# Altium project PCB_15122020_01BB.PrjPcb (part 8 of 9)

## Sheet RTC_SD_HDMI.SchDoc
size A3
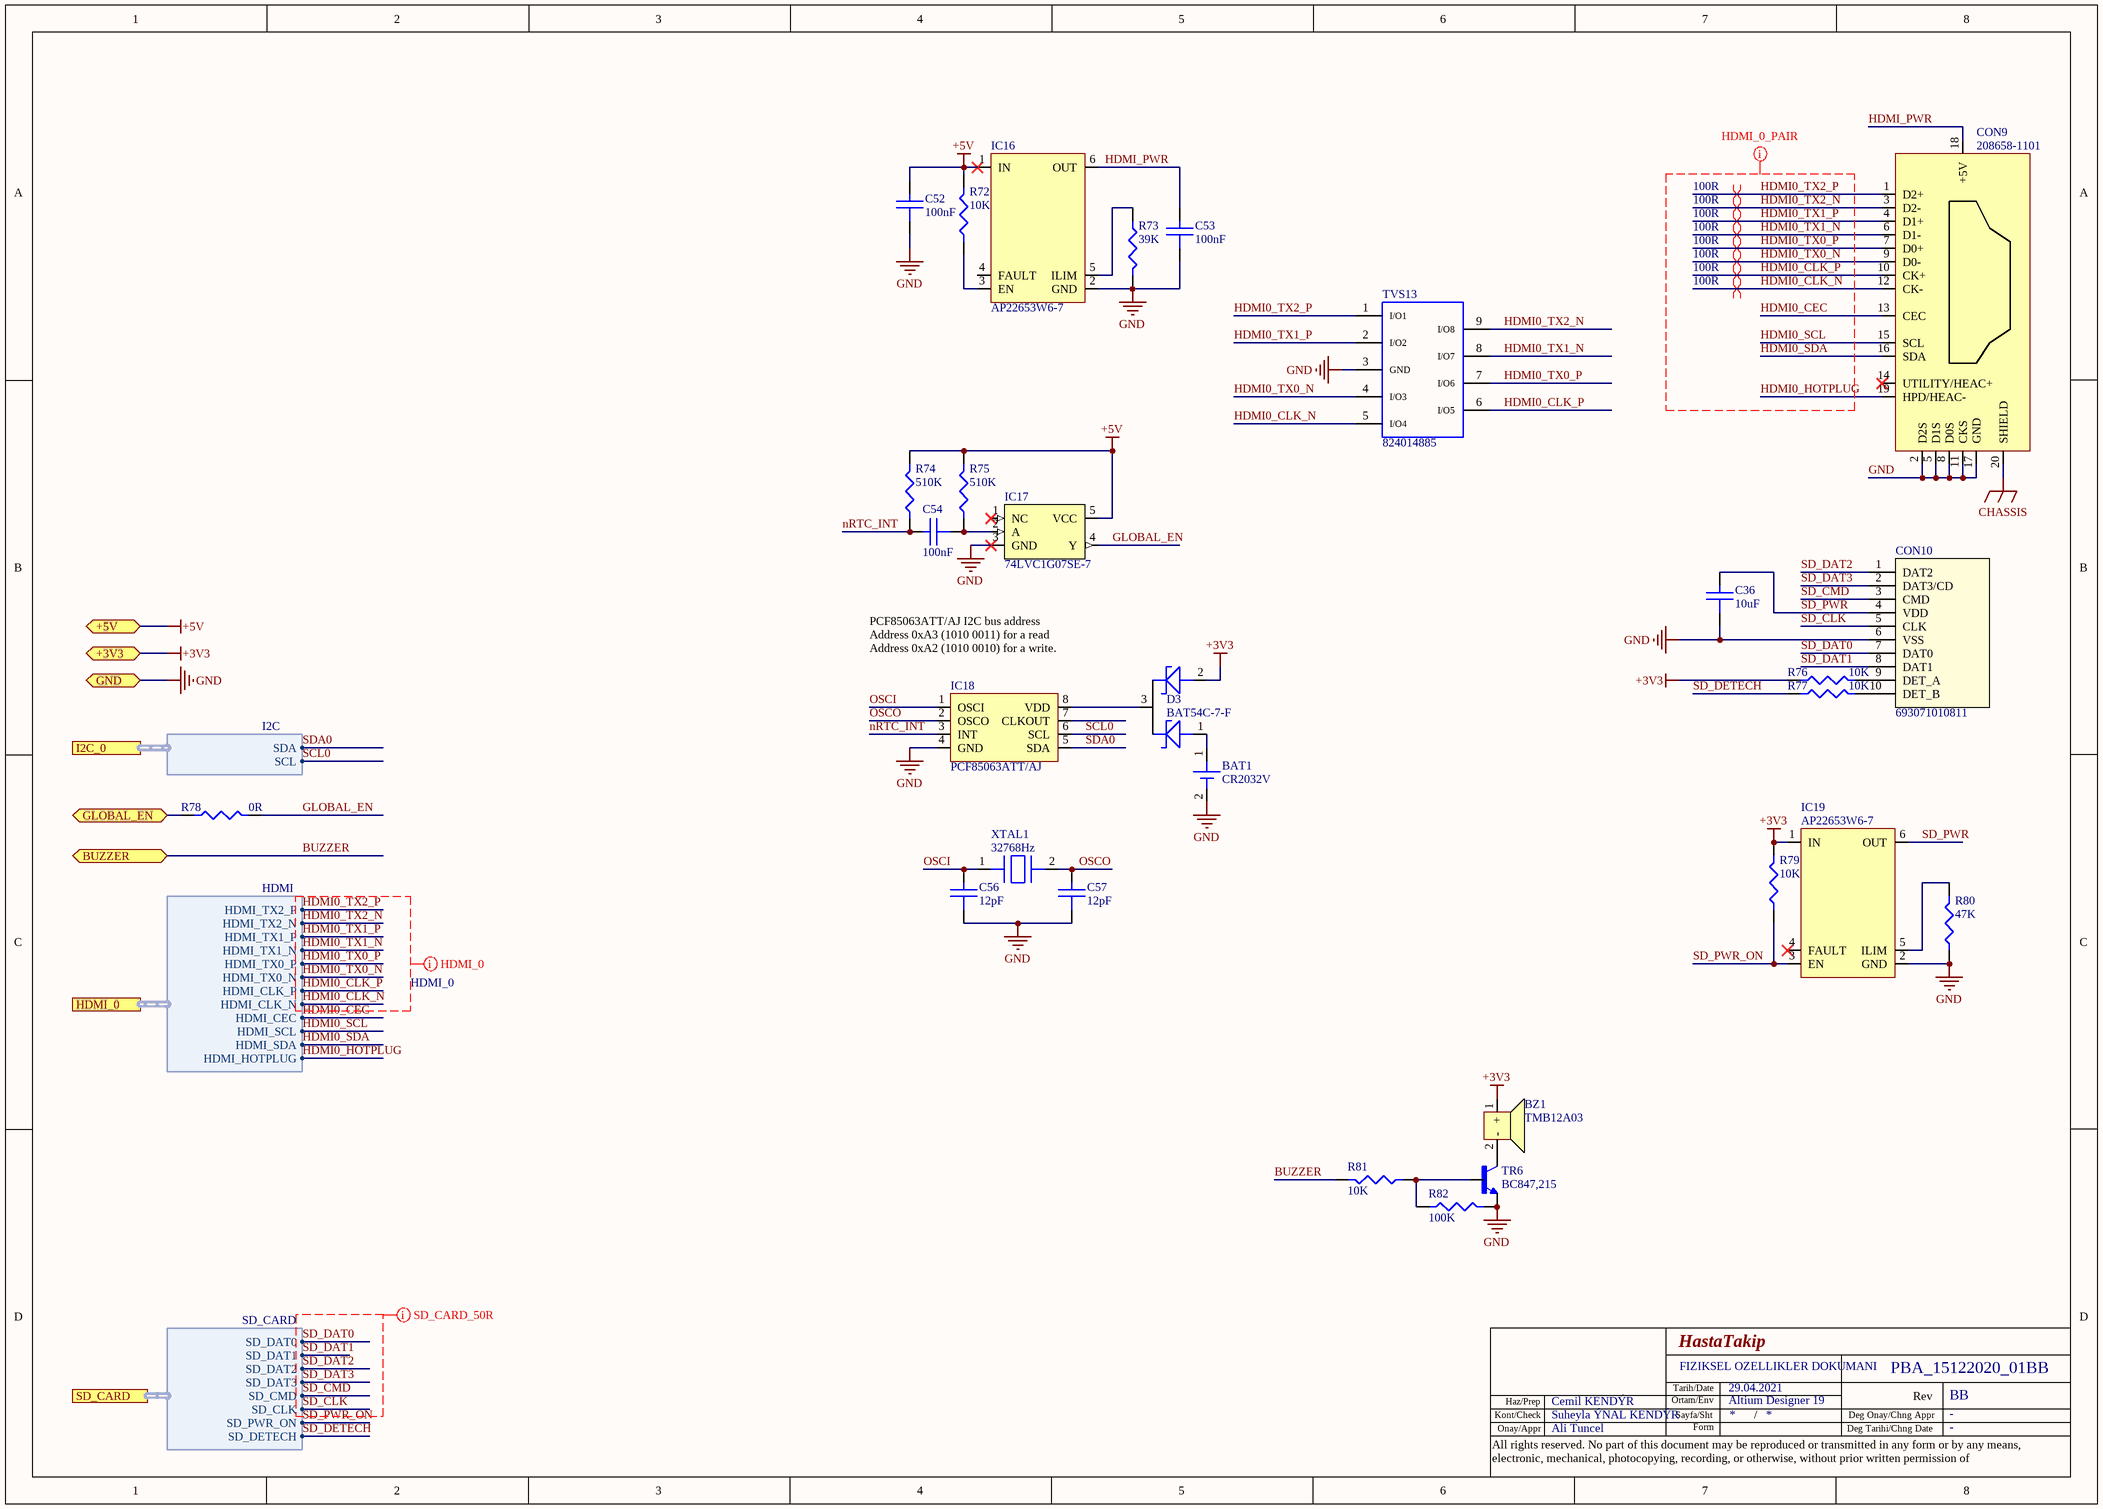
[diagram p8: RTC_SD_HDMI.SchDoc]

### Parts
BAT1  CR2032V  [CR2032V]
BZ1  TMB12A03  [Buzzer12mmx9.5mm]
C36  10uF  [C0603]
C52  100nF  [C0603]
C53  100nF  [C0603]
C54  100nF  [C0603]
C56  12pF  [C0603]
C57  12pF  [C0603]
CON9  208658-1101  [2086581101]
CON10  693071010811  [693071010811_WRE]
D3  BAT54C-7-F  [SOT23]
IC16  AP22653W6-7  [SOT23-6]
IC17  74LVC1G07SE-7  [SOT353]
IC18  PCF85063ATT/AJ  [SOT505-1]
IC19  AP22653W6-7  [SOT23-6]
R72  10K  [R0603]
R73  39K  [R0603]
R74  510K  [R0603]
R75  510K  [R0603]
R76  10K  [R0603]
R77  10K  [R0603]
R78  0R  [R0603]
R79  10K  [R0603]
R80  47K  [R0603]
R81  10K  [R0603]
R82  100K  [R0603]
TR6  BC847,215  [SOT23]
TVS13  824014885  [WE-TVS_DFN3810-9L]
XTAL1  32768Hz  [ForkCrystal]

### Ports
+3V3 (bidir), +5V (bidir), BUZZER (bidir), GLOBAL_EN (bidir), GND (bidir), HDMI_0 (harness HDMI), I2C_0 (harness I2C), SD_CARD (harness SD_CARD)

### Harnesses
HDMI: HDMI_CLK_N, HDMI_TX2_P, HDMI_CLK_P, HDMI_TX0_N, HDMI_TX2_N, HDMI_TX1_P, HDMI_TX1_N, HDMI_TX0_P, HDMI_CEC, HDMI_SCL, HDMI_SDA, HDMI_HOTPLUG
SD_CARD: SD_DAT0, SD_DAT1, SD_DAT2, SD_DAT3, SD_CMD, SD_CLK, SD_PWR_ON, SD_DETECH
I2C: SCL, SDA

### Nets
+3V3: BZ1.1(+) D3.2(K) IC19.1(IN) R76.1 R79.2 ; port +3V3
+5V: C52.1 IC16.1(IN) IC17.5(VCC) R72.2 R74.2 R75.2 ; port +5V
CHASSIS: CON9.20(SHIELD)
GND: BAT1.2 C36.2 C52.2 C53.2 C56.2 C57.2 CON9.2(D2S) CON9.5(D1S) CON9.8(D0S) CON9.11(CKS) CON9.17(GND) CON10.6(VSS) IC16.2(GND) IC17.3(GND) IC18.4(GND) IC19.2(GND) R73.2 R80.1 R82.2 TR6.2(E) TVS13.3(GND) ; port GND
BUZZER: R81.2 ; port BUZZER
GLOBAL_EN: IC17.4(Y) R78.2
GLOBAL_EN_PIN: R78.1 ; port GLOBAL_EN
HDMI0_CEC: CON9.13(CEC) ; port HDMI_0.HDMI_CEC
HDMI0_CLK_N: CON9.12(CK-) TVS13.5(I/O4) ; port HDMI_0.HDMI_CLK_N
HDMI0_CLK_P: CON9.10(CK+) TVS13.6(I/O5) ; port HDMI_0.HDMI_CLK_P
HDMI0_HOTPLUG: CON9.19(HPD/HEAC-) ; port HDMI_0.HDMI_HOTPLUG
HDMI0_SCL: CON9.15(SCL) ; port HDMI_0.HDMI_SCL
HDMI0_SDA: CON9.16(SDA) ; port HDMI_0.HDMI_SDA
HDMI0_TX0_N: CON9.9(D0-) TVS13.4(I/O3) ; port HDMI_0.HDMI_TX0_N
HDMI0_TX0_P: CON9.7(D0+) TVS13.7(I/O6) ; port HDMI_0.HDMI_TX0_P
HDMI0_TX1_N: CON9.6(D1-) TVS13.8(I/O7) ; port HDMI_0.HDMI_TX1_N
HDMI0_TX1_P: CON9.4(D1+) TVS13.2(I/O2) ; port HDMI_0.HDMI_TX1_P
HDMI0_TX2_N: CON9.3(D2-) TVS13.9(I/O8) ; port HDMI_0.HDMI_TX2_N
HDMI0_TX2_P: CON9.1(D2+) TVS13.1(I/O1) ; port HDMI_0.HDMI_TX2_P
HDMI_PWR: C53.1 CON9.18(+5V) IC16.6(OUT)
nRTC_INT: C54.1 IC18.3(INT) R74.1
OSCI: C56.1 IC18.1(OSCI) XTAL1.1
OSCO: C57.1 IC18.2(OSCO) XTAL1.2
SCL0: IC18.6(SCL) ; port I2C_0.SCL
SD_CLK: CON10.5(CLK) ; port SD_CARD.SD_CLK
SD_CMD: CON10.3(CMD) ; port SD_CARD.SD_CMD
SD_DAT0: CON10.7(DAT0) ; port SD_CARD.SD_DAT0
SD_DAT1: CON10.8(DAT1) ; port SD_CARD.SD_DAT1
SD_DAT2: CON10.1(DAT2) ; port SD_CARD.SD_DAT2
SD_DAT3: CON10.2(DAT3/CD) ; port SD_CARD.SD_DAT3
SD_DETECH: R77.1 ; port SD_CARD.SD_DETECH  [project net GPIO25]
SD_PWR: C36.1 CON10.4(VDD) IC19.6(OUT)
SD_PWR_ON: IC19.3(EN) R79.1 ; port SD_CARD.SD_PWR_ON
SDA0: IC18.5(SDA) ; port I2C_0.SDA
NetBAT1_1: BAT1.1 D3.1(A)
NetBZ1_2: BZ1.2(-) TR6.3(C)
NetC54_2: C54.2 IC17.2(A) R75.1
NetCON10_9: CON10.9(DET_A) R76.2
NetCON10_10: CON10.10(DET_B) R77.2
NetD3_3: D3.3(K) IC18.8(VDD)
NetIC16_3: IC16.3(EN) R72.1
NetIC16_5: IC16.5(ILIM) R73.1
NetIC19_5: IC19.5(ILIM) R80.2
NetR81_1: R81.1 R82.1 TR6.1(B)

Not connected (* = marked no-connect by the designer): CON9 14(UTILITY/HEAC+)*; IC16 4(FAULT); IC17 1(NC)*; IC18 7(CLKOUT); IC19 4(FAULT)*

### Layout directives
mark named HDMI_0_PAIR: HDMI0_CEC, HDMI0_CLK_N, HDMI0_CLK_P, HDMI0_HOTPLUG, HDMI0_SCL, HDMI0_SDA, HDMI0_TX0_N, HDMI0_TX0_P, HDMI0_TX1_N, HDMI0_TX1_P, HDMI0_TX2_N, HDMI0_TX2_P
differential pair; differential pair class 100R: HDMI0_CLK_N, HDMI0_CLK_P, HDMI0_TX0_N, HDMI0_TX0_P, HDMI0_TX1_N, HDMI0_TX1_P, HDMI0_TX2_N, HDMI0_TX2_P
net class SD_CARD: SD_CLK, SD_CMD, SD_DAT0, SD_DAT1, SD_DAT2, SD_DAT3
net class HDMI_0: HDMI0_CLK_N, HDMI0_CLK_P, HDMI0_TX0_N, HDMI0_TX0_P, HDMI0_TX1_N, HDMI0_TX1_P, HDMI0_TX2_N, HDMI0_TX2_P

### Notes on the sheet
- (near D3) PCF85063ATT/AJ I2C bus address
  Address 0xA3 (1010 0011) for a read
  Address 0xA2 (1010 0010) for a write.
- Tarih/Date
- Kont/Check
- Onay/Appr
- Haz/Prep
- Ortam/Env
- Sayfa/Sht
- Form
- /
- Deg Tarihi/Chng Date
- Deg Onay/Chng Appr
- Rev
- All rights reserved. No part of this document may be reproduced or transmitted in any form or by any means, electronic, mechanical, photocopying, recording, or otherwise, without prior written permission of

### Library data of the parts
BAT1 = CR2032V: CR2032 Dikey Montaj; Category: Battery
BZ1 = TMB12A03: BUZZER DEVRELI 12MM 3V 2300+300Hz H:9,5MM; Category: Buzzer; Manufacturer: TMB12A03
C36 = CC0603MRX5R6BB106: as C12-C15 on sheet Power; Supplier 1: Digi-Key; Supplier Part Number 1: 311-1817-1-ND; Manufacturer Part Number: CC0603MRX5R6BB106; Stock 1: 209492; Pricing 1: 1 = 0,20000, 10 = 0,13700, 50 = 0,08200, 100 = 0,06920, 500 = 0,04736, 1000 = 0,04190 (USD); RoHS: Yes; Mount: Surface Mount; Case/Package: 0603; Case Code (Imperial): 0603; Case Code (Metric): 1608; Weight: 7.1E-05oz; Min Operating Temperature: -55°C; Max Operating Temperature: 85°C; Voltage Rating: 10V; Termination: SMD/SMT; Resistor Type: Ceramic; Dielectric: X5R; Tolerance: 20%; Packaging: Tape and Reel; Capacitance: 10uF; Voltage Rating (DC): 10V; Length: 0.063inch; Width: 0.031inch; Thickness: 0.035inch; Depth: 0.8mm; Lead Free: Lead Free; Halogen Free: Halogen Free; ComponentLink1URL: http://components.arrow.com/part/dataview/0323_03079270?src-supplier=Arrow+Europe; ComponentLink1Description: http://components.arrow.com/part/dataview/0323_03079270?src-supplier=Arrow+Europe; ComponentLink2URL: http://www.mouser.com/ds/2/447/UPY-GPHC_X5R_4V-to-50V_25-1131599.pdf?src-supplier=Mouser; ComponentLink2Description: http://www.mouser.com/ds/2/447/UPY-GPHC_X5R_4V-to-50V_25-1131599.pdf?src-supplier=Mouser; ComponentLink3URL: http://www.yageo.com/documents/recent/UPY-GPHC_X5R_4V-to-50V_25.pdf?src-supplier=Digi-Key; ComponentLink3Description: http://www.yageo.com/documents/recent/UPY-GPHC_X5R_4V-to-50V_25.pdf?src-supplier=Digi-Key; Category: Capasitor
C52-C54 = CC0603KRX7R8BB104: 100nF, 25V, X7R, 10%, 0603; Manufacturer: Yageo; Supplier 1: Digi-Key; Supplier Part Number 1: 311-1341-1-ND; Manufacturer Part Number: CC0603KRX7R8BB104; Stock 1: 10150433; Pricing 1: 1 = 0,10000, 10 = 0,04500, 50 = 0,02480, 100 = 0,02020, 500 = 0,01444, 1000 = 0,01134 (USD); RoHS: Yes; Mount: Surface Mount; Case/Package: 0603; Number of Pins: 2; Case Code (Imperial): 0603; Case Code (Metric): 1608; Min Operating Temperature: -55°C; Max Operating Temperature: 125°C; Capacitance: 100nF; Tolerance: 10%; Voltage Rating: 25V; Packaging: Tape and Reel; Package Quantity: 1; Voltage Rating (DC): 25V; Dielectric: X7R; Termination: SMD/SMT; Resistor Type: Ceramic; Voltage: 25V; Length: 1.6mm; Width: 0.8mm; Height: 0.8mm; Thickness: 0.035inch; Depth: 0.8mm; Radiation Hardening: No; REACH SVHC: Unknown; Lead Free: Lead Free; Halogen Free: Halogen Free; ComponentLink1URL: https://datasheet.ciiva.com/11786/0900766b80c10176-11786120.pdf?src-supplier=RSComponents; ComponentLink1Description: https://datasheet.ciiva.com/11786/0900766b80c10176-11786120.pdf?src-supplier=RSComponents; ComponentLink2URL: https://datasheet.ciiva.com/144/mlccorderingcode-144075.pdf?src-supplier=Digi-Key; ComponentLink2Description: https://datasheet.ciiva.com/144/mlccorderingcode-144075.pdf?src-supplier=Digi-Key; ComponentLink3URL: https://datasheet.ciiva.com/17434/upy-gphc-x7r-6-3v-to-50v-8-17434263.pdf?src-supplier=Avnet+Europe; ComponentLink3Description: https://datasheet.ciiva.com/17434/upy-gphc-x7r-6-3v-to-50v-8-17434263.pdf?src-supplier=Avnet+Europe; ComponentLink4URL: https://datasheet.ciiva.com/26829/getdatasheetpartid-403577-26829431.pdf?src-supplier=Verical; ComponentLink4Description: https://datasheet.ciiva.com/26829/getdatasheetpartid-403577-26829431.pdf?src-supplier=Verical; ComponentLink5URL: https://datasheet.ciiva.com/11587/upy-gphc-x7r-6-3v-to-50v-8-11587208.pdf?src-supplier=Avnet; ComponentLink5Description: https://datasheet.ciiva.com/11587/upy-gphc-x7r-6-3v-to-50v-8-11587208.pdf?src-supplier=Avnet; ComponentLink6URL: https://datasheet.ciiva.com/13389/upy-gphc-x7r-6-3v-to-50v-8-13389352.pdf?src-supplier=Mouser; ComponentLink6Description: https://datasheet.ciiva.com/13389/upy-gphc-x7r-6-3v-to-50v-8-13389352.pdf?src-supplier=Mouser; ComponentLink7URL: https://datasheet.ciiva.com/28450/1489800-28450584.pdf?src-supplier=Element14; ComponentLink7Description: https://datasheet.ciiva.com/28450/1489800-28450584.pdf?src-supplier=Element14; ComponentLink8URL: https://datasheet.ciiva.com/144/mlccorderingcode-144073.pdf?src-supplier=Digi-Key; ComponentLink8Description: https://datasheet.ciiva.com/144/mlccorderingcode-144073.pdf?src-supplier=Digi-Key; ComponentLink9URL: https://datasheet.ciiva.com/144/mlccorderingcode-144074.pdf?src-supplier=Digi-Key; ComponentLink9Description: https://datasheet.ciiva.com/144/mlccorderingcode-144074.pdf?src-supplier=Digi-Key; ComponentLink10URL: https://datasheet.ciiva.com/7978/1489800-7978155.pdf?src-supplier=Element14; ComponentLink10Description: https://datasheet.ciiva.com/7978/1489800-7978155.pdf?src-supplier=Element14; Category: Capasitor
C56 C57 = CC0603JRNPO9BN120: 12pF 50V C0G 5% SMD 0603 125C T/R; Manufacturer: Yageo; Dielectric Material: Ceramic; Insulation Resistance: 100GR; Supplier 1: Digi-Key; Supplier Part Number 1: 311-1059-1-ND; Manufacturer Part Number: CC0603JRNPO9BN120; Stock 1: 139479; Pricing 1: 1 = 0,10000, 10 = 0,05600, 50 = 0,03040, 100 = 0,02480, 500 = 0,01774, 1000 = 0,01395 (USD); RoHS: Yes; Mount: Surface Mount; Case/Package: 0603; Number of Pins: 2; Case Code (Metric): 1608; Case Code (Imperial): 0603; Min Operating Temperature: -55°C; Max Operating Temperature: 125°C; Capacitance: 12pF; Tolerance: 5%; Packaging: Tape and Reel; Voltage Rating (DC): 50V; Dielectric: C0G; Package Quantity: 1; Voltage Rating: 50V; Termination: SMD/SMT; Resistor Type: Ceramic; Length: 1.6mm; Width: 0.031inch; Height: 0.8mm; Thickness: 0.035inch; Depth: 0.8mm; Radiation Hardening: No; REACH SVHC: No SVHC; Lead Free: Lead Free; ComponentLink1URL: https://datasheet.ciiva.com/144/mlccorderingcode-144448.pdf?src-supplier=Digi-Key; ComponentLink1Description: https://datasheet.ciiva.com/144/mlccorderingcode-144448.pdf?src-supplier=Digi-Key; ComponentLink2URL: https://datasheet.ciiva.com/144/mlccorderingcode-144449.pdf?src-supplier=Digi-Key; ComponentLink2Description: https://datasheet.ciiva.com/144/mlccorderingcode-144449.pdf?src-supplier=Digi-Key; ComponentLink3URL: https://datasheet.ciiva.com/144/mlccorderingcode-144450.pdf?src-supplier=Digi-Key; ComponentLink3Description: https://datasheet.ciiva.com/144/mlccorderingcode-144450.pdf?src-supplier=Digi-Key; ComponentLink4URL: https://datasheet.ciiva.com/8033/1734582-8033717.pdf?src-supplier=Element14; ComponentLink4Description: https://datasheet.ciiva.com/8033/1734582-8033717.pdf?src-supplier=Element14; ComponentLink5URL: https://datasheet.ciiva.com/5425/upy-gp-np0-16v-to-50v-8-5425478.pdf?src-supplier=Mouser; ComponentLink5Description: https://datasheet.ciiva.com/5425/upy-gp-np0-16v-to-50v-8-5425478.pdf?src-supplier=Mouser; ComponentLink6URL: https://datasheet.ciiva.com/8033/1734582-8033718.pdf?src-supplier=Element14; ComponentLink6Description: https://datasheet.ciiva.com/8033/1734582-8033718.pdf?src-supplier=Element14; ComponentLink7URL: https://datasheet.ciiva.com/11464/upy-gp-np0-16v-to-50v-8-11464726.pdf?src-supplier=Avnet; ComponentLink7Description: https://datasheet.ciiva.com/11464/upy-gp-np0-16v-to-50v-8-11464726.pdf?src-supplier=Avnet; ComponentLink8URL: https://datasheet.ciiva.com/28450/1443161-28450470.pdf?src-supplier=Element14; ComponentLink8Description: https://datasheet.ciiva.com/28450/1443161-28450470.pdf?src-supplier=Element14; ComponentLink9URL: https://datasheet.ciiva.com/16625/upy-gp-np0-16v-to-50v-8-16625516.pdf?src-supplier=Avnet+Europe; ComponentLink9Description: https://datasheet.ciiva.com/16625/upy-gp-np0-16v-to-50v-8-16625516.pdf?src-supplier=Avnet+Europe; Category: Capasitor
CON9 = 208658-1101: HDMI; 0.5mm; v2.1; RT Angle; w/o Mylar; w/o Flange; 19 Circuits; Manufacturer: Molex; Supplier 1: Digi-Key; Supplier Part Number 1: 900-2086581101CT-ND; Manufacturer Part Number: 208658-1101; Stock 1: 1640; Pricing 1: 1 = 2,36000, 10 = 2,01000, 100 = 1,66040 (USD); RoHS: No; Category: Connectors, Interconnects HDMI Connectors
CON10 = 693071010811: Micro SD, 8 Contacts,; Manufacturer: Wurth Electronics; Number of Contacts: 8; Connector Type: Connector; Supplier 1: Digi-Key; Supplier Part Number 1: 732-3819-1-ND; Manufacturer Part Number: 693071010811; Stock 1: 3848; Pricing 1: 1 = 2,92000, 10 = 2,85600, 50 = 2,51300, 100 = 2,39900, 500 = 2,05600 (USD); RoHS: Yes; Mount: Surface Mount; Contact Material: Copper Alloy,Copper,Gold; Contact Plating: Gold; Min Operating Temperature: -25°C; Max Operating Temperature: 85°C; Package Quantity: 1; Packaging: Tape and Reel; Length: 14mm; Width: 15.2mm; Height: 1.98mm; REACH SVHC: Unknown; Lead Free: Lead Free; ComponentLink1URL: https://datasheet.ciiva.com/1104/1759178-1104796.pdf?src-supplier=Element14; ComponentLink1Description: https://datasheet.ciiva.com/1104/1759178-1104796.pdf?src-supplier=Element14; ComponentLink2URL: https://datasheet.ciiva.com/6935/693071010811-6935152.pdf?src-supplier=Digi-Key; ComponentLink2Description: https://datasheet.ciiva.com/6935/693071010811-6935152.pdf?src-supplier=Digi-Key; ComponentLink3URL: https://datasheet.ciiva.com/25605/0900766b81113f2e-25605369.pdf?src-supplier=RSComponents; ComponentLink3Description: https://datasheet.ciiva.com/25605/0900766b81113f2e-25605369.pdf?src-supplier=RSComponents; ComponentLink4URL: https://datasheet.ciiva.com/6935/693071010811-6935146.pdf?src-supplier=Digi-Key; ComponentLink4Description: https://datasheet.ciiva.com/6935/693071010811-6935146.pdf?src-supplier=Digi-Key; Category: Connectors, Interconnects Memory Connectors - PC Card Sockets
D3 = BAT54C-7-F: Diodes Inc BAT54C-7-F, Dual SMT Schottky Switching Diode, Common Cathode, 30V 200mA, 5ns, 3-Pin SOT-23; Power Rating: 200mW; Capacitance: 10pF; Forward Voltage: 800mV; Max Reverse Current: 2uA; Peak Non-Repetitive Surge Current: 600mA; Supplier 1: Digi-Key; Supplier Part Number 1: BAT54C-FDICT-ND; Manufacturer: Diodes; Manufacturer Part Number: BAT54C-7-F; Stock 1: 151567; Pricing 1: 1 = 0,18000, 10 = 0,13000, 100 = 0,07040, 500 = 0,05530, 1000 = 0,03840 (USD); RoHS: Yes; Mount: Surface Mount; Case/Package: SOT-23; Number of Pins: 3; Contact Plating: Tin,Matte; Weight: 0.000282oz; Min Operating Temperature: -65°C; Max Operating Temperature: 150°C; Current Rating: 200mA; Voltage Rating (DC): 30V; Package Quantity: 3000; Element Configuration: Common Cathode; Packaging: Tape and Reel; Forward Current: 200mA; Average Rectified Current: 200mA; Reverse Recovery Time: 5ns; Max Repetitive Reverse Voltage (Vrrm): 30V; Max Forward Surge Current (Ifsm): 600mA; Max Power Dissipation: 200mW; Power Dissipation: 200mW; Termination: SMD/SMT; Max Reverse Voltage (DC): 30V; Length: 2.9mm; Width: 1.3mm; Height: 1mm; Radiation Hardening: No; Lead Free: Lead Free; REACH SVHC: No SVHC; ComponentLink1URL: https://datasheet.ciiva.com/904/ds11005-904592.pdf?src-supplier=Digi-Key; ComponentLink1Description: https://datasheet.ciiva.com/904/ds11005-904592.pdf?src-supplier=Digi-Key; ComponentLink2URL: https://datasheet.ciiva.com/15143/getdatasheetpartid-29884-15143959.pdf?src-supplier=Verical; ComponentLink2Description: https://datasheet.ciiva.com/15143/getdatasheetpartid-29884-15143959.pdf?src-supplier=Verical; ComponentLink3URL: https://datasheet.ciiva.com/22695/1911820-22695254.pdf?src-supplier=Element14; ComponentLink3Description: https://datasheet.ciiva.com/22695/1911820-22695254.pdf?src-supplier=Element14; Category: Diode
IC16 IC19 = AP22653W6-7: Power Switch/Driver 1:1 P-Channel 2.1A SOT-23-6; Manufacturer: Diodes; Supplier 1: Digi-Key; Manufacturer Part Number: AP22653W6-7; Stock 1: 12659; Pricing 1: 1 = 0,42000, 10 = 0,35600, 25 = 0,33200, 100 = 0,24670, 250 = 0,20880, 500 = 0,19930, 1000 = 0,14710 (USD); RoHS: No; Supplier Part Number 1: 31-AP22653W6-7CT-ND; Category: Integrated Circuits - PMIC - Power Distribution Switches, Load Drivers
IC17 = 74LVC1G07SE-7: Buffer/Driver 1-CH Non-Inverting Open Drain CMOS 5-Pin SOT-353 T/R; Manufacturer: Diodes; Number of Gates: 1; Max Supply Voltage: 5.5V; Min Supply Voltage: 1.65V; Propagation Delay: 8.5ns; Logic Function: Buffer,Inverting; Polarity: Inverting,Non-Inverting; Low Level Output Current: 32mA; Operating Supply Current: 10uA; Quiescent Current: 200uA; Supplier 1: Digi-Key; Supplier Part Number 1: 74LVC1G07SE-7DICT-ND; Manufacturer Part Number: 74LVC1G07SE-7; Stock 1: 16164; Pricing 1: 1 = 0,26000, 10 = 0,21500, 25 = 0,18000, 100 = 0,11400, 250 = 0,08800, 500 = 0,07500, 1000 = 0,05100 (USD); RoHS: Yes; Mount: Surface Mount; Case/Package: SOT-353; Number of Pins: 5; Min Operating Temperature: -40°C; Max Operating Temperature: 85°C; Number of Inputs: 1; Packaging: Tape and Reel; Package Quantity: 3000; Number of Elements: 1; Number of Channels: 1; Number of Outputs: 1; Number of Input Lines: 1; Number of Output Lines: 1; Number of Bits per Element: 1; Turn-On Delay Time: 8.5ns; Length: 2.2mm; Width: 1.35mm; Height: 1mm; Radiation Hardening: No; REACH SVHC: No SVHC; Lead Free: Lead Free; ComponentLink1URL: https://datasheet.ciiva.com/8260/74lvc1g07-8260976.pdf?src-supplier=Avnet; ComponentLink1Description: https://datasheet.ciiva.com/8260/74lvc1g07-8260976.pdf?src-supplier=Avnet; ComponentLink2URL: https://datasheet.ciiva.com/26856/getdatasheetpartid-302086-26856250.pdf?src-supplier=Verical; ComponentLink2Description: https://datasheet.ciiva.com/26856/getdatasheetpartid-302086-26856250.pdf?src-supplier=Verical; ComponentLink3URL: https://datasheet.ciiva.com/1832/74lvc1g07-1832566.pdf?src-supplier=Digi-Key; ComponentLink3Description: https://datasheet.ciiva.com/1832/74lvc1g07-1832566.pdf?src-supplier=Digi-Key; ComponentLink4URL: https://datasheet.ciiva.com/1832/74lvc1g07-1832567.pdf?src-supplier=Digi-Key; ComponentLink4Description: https://datasheet.ciiva.com/1832/74lvc1g07-1832567.pdf?src-supplier=Digi-Key; ComponentLink5URL: https://datasheet.ciiva.com/1832/74lvc1g07-1832568.pdf?src-supplier=Digi-Key; ComponentLink5Description: https://datasheet.ciiva.com/1832/74lvc1g07-1832568.pdf?src-supplier=Digi-Key; ComponentLink6URL: https://datasheet.ciiva.com/1506/74lvc1g07-1506202.pdf?src-supplier=Element14; ComponentLink6Description: https://datasheet.ciiva.com/1506/74lvc1g07-1506202.pdf?src-supplier=Element14; ComponentLink7URL: https://datasheet.ciiva.com/17291/74lvc1g07-17291948.pdf?src-supplier=Avnet+Europe; ComponentLink7Description: https://datasheet.ciiva.com/17291/74lvc1g07-17291948.pdf?src-supplier=Avnet+Europe; ComponentLink8URL: https://datasheet.ciiva.com/8305/74lvc1g07-8305775.pdf?src-supplier=Avnet; ComponentLink8Description: https://datasheet.ciiva.com/8305/74lvc1g07-8305775.pdf?src-supplier=Avnet; Category: Integrated Circuits (ICs) Logic - Buffers, Drivers, Receivers, Transceivers
IC18 = PCF85063ATT/AJ: Real time clock, TSSOP-8,; Manufacturer: NXP Semiconductors; Interface: I2C,Serial,2-Wire; Max Supply Voltage: 5.5V; Min Supply Voltage: 900mV; Time Format: HH:MM:SS (12/24 hr); Date Format: YY-MM-DD-dd; Supplier 1: Digi-Key; Supplier Part Number 1: 568-12404-1-ND; Manufacturer Part Number: PCF85063ATT/AJ; Stock 1: 34322; Pricing 1: 1 = 0,83000, 10 = 0,73300, 25 = 0,68880, 100 = 0,56220, 250 = 0,52216, 500 = 0,44440, 1000 = 0,35552 (USD); RoHS: Yes; Mount: Surface Mount; Case/Package: TSSOP; Number of Pins: 8; Contact Plating: Gold; Min Operating Temperature: -40°C; Max Operating Temperature: 85°C; Packaging: Tape and Reel; Logic Function: Clock; Lead Free: Lead Free; ComponentLink1URL: http://www.farnell.com/datasheets/2014362.pdf?src-supplier=Farnell; ComponentLink1Description: http://www.farnell.com/datasheets/2014362.pdf?src-supplier=Farnell; ComponentLink2URL: https://www.nxp.com/docs/en/data-sheet/PCF85063A.pdf?src-supplier=Digi-Key; ComponentLink2Description: https://www.nxp.com/docs/en/data-sheet/PCF85063A.pdf?src-supplier=Digi-Key; ComponentLink3URL: http://www.nxp.com/documents/data_sheet/PCF85063A.pdf?src-supplier=Avnet+Asia; ComponentLink3Description: http://www.nxp.com/documents/data_sheet/PCF85063A.pdf?src-supplier=Avnet+Asia; ComponentLink4URL: http://www.nxp.com/documents/data_sheet/PCF85063A.pdf?src-supplier=Avnet; ComponentLink4Description: http://www.nxp.com/documents/data_sheet/PCF85063A.pdf?src-supplier=Avnet; Category: Integrated Circuits (ICs) Clock/Timing - Real Time Clocks
R72 R76 R77 R79 R81 = RT0603FRE0710KL: 10K OHM 1% 1/10W 0603; Manufacturer: Yageo; Resistance: 10kR; Power Rating: 100mW; Voltage Rating: 75V; Temperature Coefficient: 50ppm/°C; Supplier 1: Digi-Key; Supplier Part Number 1: YAG2321CT-ND; Manufacturer Part Number: RT0603FRE0710KL; Stock 1: 326134; Pricing 1: 1 = 0,10000, 10 = 0,05600, 100 = 0,02270, 1000 = 0,01020, 2500 = 0,00886 (USD); RoHS: Yes; Case/Package: 0603; Number of Pins: 2; Case Code (Metric): 1608; Case Code (Imperial): 0603; Contact Plating: Tin,Lead; Min Operating Temperature: -55°C; Max Operating Temperature: 125°C; Package Quantity: 5000; Packaging: Tape and Reel; Tolerance: 1%; Resistor Type: Thin Film; Number of Terminations: 2; Termination: SMD/SMT; Max Power Dissipation: 100mW; Voltage Rating (DC): 75V; Features: Moisture Resistant; Length: 0.063inch; Width: 0.031inch; Height: 0.022inch; Depth: 0.8mm; REACH SVHC: Unknown; Military Standard: Not; Lead Free: Lead Free; ComponentLink1URL: https://datasheet.ciiva.com/2559/pyu-rt-1-to-0-05-rohs-l-5-2559482.pdf?src-supplier=Digi-Key; ComponentLink1Description: https://datasheet.ciiva.com/2559/pyu-rt-1-to-0-05-rohs-l-5-2559482.pdf?src-supplier=Digi-Key; ComponentLink2URL: https://datasheet.ciiva.com/16745/pyu-rt-1-to-0-05-rohs-l-4-16745739.pdf?src-supplier=Future+Electronics; ComponentLink2Description: https://datasheet.ciiva.com/16745/pyu-rt-1-to-0-05-rohs-l-4-16745739.pdf?src-supplier=Future+Electronics; ComponentLink3URL: https://datasheet.ciiva.com/12694/pyu-rt-1-to-0-05-rohs-l-4-12694910.pdf?src-supplier=Mouser; ComponentLink3Description: https://datasheet.ciiva.com/12694/pyu-rt-1-to-0-05-rohs-l-4-12694910.pdf?src-supplier=Mouser; Category: Resistor
R73 = RC0603FR-0739KL: 39K, 1%, 1/10W, 0603; Manufacturer: Yageo; Resistance: 39kR; Power Rating: 100mW; Voltage Rating: 50V; Temperature Coefficient: 100ppm/°C; Supplier 1: Digi-Key; Supplier Part Number 1: 311-39.0KHRCT-ND; Manufacturer Part Number: RC0603FR-0739KL; Stock 1: 1181731; Pricing 1: 1 = 0,10000, 10 = 0,02100, 100 = 0,00840, 1000 = 0,00379, 2500 = 0,00329 (USD); RoHS: Yes; Case/Package: 0603; Number of Pins: 2; Case Code (Imperial): 0603; Case Code (Metric): 1608; Min Operating Temperature: -55°C; Max Operating Temperature: 155°C; Tolerance: 1%; Voltage Rating (DC): 50V; Packaging: Tape and Reel; Termination: SMD/SMT; Resistor Type: Thick Film; Length: 1.6mm; Width: 0.8mm; Height: 0.45mm; Depth: 0.8mm; REACH SVHC: No SVHC; Military Standard: Not; Lead Free: Lead Free; ComponentLink1URL: https://datasheet.ciiva.com/11819/0900766b80f96399-11819356.pdf?src-supplier=RSComponents; ComponentLink1Description: https://datasheet.ciiva.com/11819/0900766b80f96399-11819356.pdf?src-supplier=RSComponents; ComponentLink2URL: https://datasheet.ciiva.com/7746/443971-7746341.pdf?src-supplier=Element14; ComponentLink2Description: https://datasheet.ciiva.com/7746/443971-7746341.pdf?src-supplier=Element14; Category: Resistor
R74 R75 = RC0603FR-07510KL: 510K, 1%, 1/10W, 0603; Manufacturer: Yageo; Power Rating: 100mW; Resistance: 510kR; Voltage Rating: 50V; Temperature Coefficient: 100ppm/°C; Supplier 1: Digi-Key; Supplier Part Number 1: 311-510KHRCT-ND; Manufacturer Part Number: RC0603FR-07510KL; Stock 1: 184765; Pricing 1: 1 = 0,10000, 10 = 0,02100, 100 = 0,00840, 1000 = 0,00379, 2500 = 0,00329 (USD); RoHS: Yes; Case/Package: 0603; Case Code (Imperial): 0603; Case Code (Metric): 1608; Min Operating Temperature: -55°C; Max Operating Temperature: 155°C; Tolerance: 1%; Packaging: Tape and Reel; Package Quantity: 1; Termination: SMD/SMT; Resistor Type: Thick Film; Number of Terminations: 2; Max Power Dissipation: 100mW; Voltage Rating (DC): 50V; Features: Moisture Resistant; Length: 1.6mm; Width: 0.8mm; Height: 0.022inch; Depth: 0.8mm; Lead Free: Lead Free; Military Standard: Not; ComponentLink1URL: https://datasheet.ciiva.com/12555/rc0603-272842-12555383.pdf?src-supplier=Mouser; ComponentLink1Description: https://datasheet.ciiva.com/12555/rc0603-272842-12555383.pdf?src-supplier=Mouser; ComponentLink2URL: https://datasheet.ciiva.com/2454/pyu-r-int-thick-7-2454984.pdf?src-supplier=Digi-Key; ComponentLink2Description: https://datasheet.ciiva.com/2454/pyu-r-int-thick-7-2454984.pdf?src-supplier=Digi-Key; ComponentLink3URL: https://datasheet.ciiva.com/2454/pyu-r-int-thick-7-2454985.pdf?src-supplier=Digi-Key; ComponentLink3Description: https://datasheet.ciiva.com/2454/pyu-r-int-thick-7-2454985.pdf?src-supplier=Digi-Key; ComponentLink4URL: https://datasheet.ciiva.com/2454/pyu-r-int-thick-7-2454986.pdf?src-supplier=Digi-Key; ComponentLink4Description: https://datasheet.ciiva.com/2454/pyu-r-int-thick-7-2454986.pdf?src-supplier=Digi-Key; Category: Resistor
R78 = RC0603FR-070RL: as R40-R42 on sheet RaspberyConnector; Supplier 1: Digi-Key; Supplier Part Number 1: 311-0.0HRCT-ND; Manufacturer Part Number: RC0603FR-070RL; Stock 1: 513794; Pricing 1: 1 = 0,10000, 10 = 0,01800, 25 = 0,01280, 50 = 0,00980, 100 = 0,00730, 250 = 0,00552, 500 = 0,00442, 1000 = 0,00326 (USD); RoHS: Yes; Case/Package: 0603; Number of Pins: 2; Case Code (Metric): 1608; Case Code (Imperial): 0603; Contact Plating: Tin,Matte; Min Operating Temperature: -55°C; Max Operating Temperature: 155°C; Packaging: Tape and Reel; Package Quantity: 5000; Resistor Type: Thick Film; Number of Terminations: 2; Termination: SMD/SMT; Max Power Dissipation: 100mW; Voltage Rating (DC): 50V; Features: Moisture Resistant; Length: 1.6mm; Width: 0.031inch; Height: 0.45mm; Depth: 0.8mm; Radiation Hardening: No; REACH SVHC: No SVHC; Military Standard: Not; Lead Free: Lead Free; ComponentLink1URL: https://datasheet.ciiva.com/11808/0900766b80f96399-11808172.pdf?src-supplier=RSComponents; ComponentLink1Description: https://datasheet.ciiva.com/11808/0900766b80f96399-11808172.pdf?src-supplier=RSComponents; ComponentLink2URL: https://datasheet.ciiva.com/5558/rc0603-272842-5558341.pdf?src-supplier=Mouser; ComponentLink2Description: https://datasheet.ciiva.com/5558/rc0603-272842-5558341.pdf?src-supplier=Mouser; ComponentLink3URL: https://datasheet.ciiva.com/46382/443971-46382072.pdf?src-supplier=Element14; ComponentLink3Description: https://datasheet.ciiva.com/46382/443971-46382072.pdf?src-supplier=Element14; ComponentLink4URL: https://datasheet.ciiva.com/29721/pyu-r-int-thick-7-29721178.pdf?src-supplier=Digi-Key; ComponentLink4Description: https://datasheet.ciiva.com/29721/pyu-r-int-thick-7-29721178.pdf?src-supplier=Digi-Key; ComponentLink5URL: https://datasheet.ciiva.com/5684/443971-5684699.pdf?src-supplier=Farnell; ComponentLink5Description: https://datasheet.ciiva.com/5684/443971-5684699.pdf?src-supplier=Farnell; ComponentLink6URL: https://datasheet.ciiva.com/7983/443971-7983627.pdf?src-supplier=Element14; ComponentLink6Description: https://datasheet.ciiva.com/7983/443971-7983627.pdf?src-supplier=Element14; ComponentLink7URL: https://datasheet.ciiva.com/29721/pyu-rc0603-51-rohs-l-4-29721179.pdf?src-supplier=Digi-Key; ComponentLink7Description: https://datasheet.ciiva.com/29721/pyu-rc0603-51-rohs-l-4-29721179.pdf?src-supplier=Digi-Key; ComponentLink8URL: https://datasheet.ciiva.com/22643/1868787-22643388.pdf?src-supplier=Element14; ComponentLink8Description: https://datasheet.ciiva.com/22643/1868787-22643388.pdf?src-supplier=Element14; Category: Resistor
R80 = RC0603FR-0747KL: 47K, 50V, 1/10W, 1%, 0603; Manufacturer: Yageo; Resistance: 47kR; Temperature Coefficient: 100ppm/°C; Power Rating: 100mW; Supplier 1: Digi-Key; Supplier Part Number 1: 311-47.0KHRCT-ND; Manufacturer Part Number: RC0603FR-0747KL; Stock 1: 4802381; Pricing 1: 1 = 0,10000, 10 = 0,02100, 100 = 0,00840, 1000 = 0,00379, 2500 = 0,00329 (USD); RoHS: Yes; Case/Package: 0603; Number of Pins: 2; Case Code (Metric): 1608; Case Code (Imperial): 0603; Min Operating Temperature: -55°C; Max Operating Temperature: 155°C; Tolerance: 1%; Packaging: Tape and Reel; Voltage Rating (DC): 50V; Resistor Type: Thick Film; Voltage Rating: 50V; Termination: SMD/SMT; Package Quantity: 1; Number of Terminations: 2; Max Power Dissipation: 100mW; Features: Moisture Resistant; Length: 1.6mm; Width: 0.031inch; Height: 0.022inch; Depth: 0.8mm; REACH SVHC: Unknown; Lead Free: Lead Free; Military Standard: Not; ComponentLink1URL: https://datasheet.ciiva.com/11808/0900766b80f96399-11808118.pdf?src-supplier=RSComponents; ComponentLink1Description: https://datasheet.ciiva.com/11808/0900766b80f96399-11808118.pdf?src-supplier=RSComponents; ComponentLink2URL: https://datasheet.ciiva.com/7746/443971-7746361.pdf?src-supplier=Element14; ComponentLink2Description: https://datasheet.ciiva.com/7746/443971-7746361.pdf?src-supplier=Element14; ComponentLink3URL: https://datasheet.ciiva.com/7746/443971-7746362.pdf?src-supplier=Element14; ComponentLink3Description: https://datasheet.ciiva.com/7746/443971-7746362.pdf?src-supplier=Element14; ComponentLink4URL: https://datasheet.ciiva.com/2453/pyu-r-int-thick-7-2453931.pdf?src-supplier=Digi-Key; ComponentLink4Description: https://datasheet.ciiva.com/2453/pyu-r-int-thick-7-2453931.pdf?src-supplier=Digi-Key; ComponentLink5URL: https://datasheet.ciiva.com/2453/pyu-r-int-thick-7-2453932.pdf?src-supplier=Digi-Key; ComponentLink5Description: https://datasheet.ciiva.com/2453/pyu-r-int-thick-7-2453932.pdf?src-supplier=Digi-Key; ComponentLink6URL: https://datasheet.ciiva.com/2453/pyu-r-int-thick-7-2453933.pdf?src-supplier=Digi-Key; ComponentLink6Description: https://datasheet.ciiva.com/2453/pyu-r-int-thick-7-2453933.pdf?src-supplier=Digi-Key; Category: Resistor
R82 = RC0603FR-07100KL: 100K ,%1 ,1/10 W ,0603; Manufacturer: Yageo; Tolerance: 1%; Resistance: 100kR; Temperature Coefficient: 100ppm/°C; Voltage Rating (DC): 50V; Power Rating: 100mW; Working Voltage: 75V; Supplier 1: Digi-Key; Supplier Part Number 1: 311-100KHRCT-ND; Manufacturer Part Number: RC0603FR-07100KL; Stock 1: 10054915; Pricing 1: 1 = 0,10000, 10 = 0,02100, 100 = 0,00840, 1000 = 0,00379, 2500 = 0,00329 (USD); RoHS: Yes; Case/Package: 0603; Number of Pins: 2; Case Code (Imperial): 0603; Case Code (Metric): 1608; Min Operating Temperature: -55°C; Max Operating Temperature: 155°C; Packaging: Tape and Reel; Resistor Type: Thick Film; Voltage Rating: 50V; Termination: SMD/SMT; Number of Terminations: 2; Length: 1.6mm; Width: 0.8mm; Height: 0.45mm; Depth: 0.8mm; REACH SVHC: No SVHC; Lead Free: Lead Free; Military Standard: Not; ComponentLink1URL: https://datasheet.ciiva.com/11808/0900766b80f96399-11808107.pdf?src-supplier=RSComponents; ComponentLink1Description: https://datasheet.ciiva.com/11808/0900766b80f96399-11808107.pdf?src-supplier=RSComponents; ComponentLink2URL: https://datasheet.ciiva.com/7983/443971-7983593.pdf?src-supplier=Element14; ComponentLink2Description: https://datasheet.ciiva.com/7983/443971-7983593.pdf?src-supplier=Element14; ComponentLink3URL: https://datasheet.ciiva.com/46440/1868787-46440889.pdf?src-supplier=Element14; ComponentLink3Description: https://datasheet.ciiva.com/46440/1868787-46440889.pdf?src-supplier=Element14; ComponentLink4URL: https://datasheet.ciiva.com/7746/1738695-7746234.pdf?src-supplier=Element14; ComponentLink4Description: https://datasheet.ciiva.com/7746/1738695-7746234.pdf?src-supplier=Element14; ComponentLink5URL: https://datasheet.ciiva.com/7746/1738695-7746235.pdf?src-supplier=Element14; ComponentLink5Description: https://datasheet.ciiva.com/7746/1738695-7746235.pdf?src-supplier=Element14; ComponentLink6URL: https://datasheet.ciiva.com/22747/443971-22747516.pdf?src-supplier=Element14; ComponentLink6Description: https://datasheet.ciiva.com/22747/443971-22747516.pdf?src-supplier=Element14; Category: Resistor
TR6 = BC847,215: TRANS NPN 45V 0.1A SOT23; Manufacturer: Nexperia; Supplier 1: Digi-Key; Supplier Part Number 1: 1727-4855-1-ND; Manufacturer Part Number: BC847,215; Stock 1: 236151; Pricing 1: 1=0,14000, 10=0,12500, 100=0,06800, 500=0,04186, 1000=0,02854 (USD); RoHS: No; ComponentLink1URL: http://www.farnell.com/datasheets/1856333.pdf?src-supplier=Farnell; ComponentLink1Description: http://www.farnell.com/datasheets/1856333.pdf?src-supplier=Farnell; ComponentLink2URL: https://assets.nexperia.com/documents/data-sheet/BC847_SER.pdf?src-supplier=Digi-Key; ComponentLink2Description: https://assets.nexperia.com/documents/data-sheet/BC847_SER.pdf?src-supplier=Digi-Key; ComponentLink3URL: http://www.farnell.com/datasheets/1856333.pdf?src-supplier=Newark; ComponentLink3Description: http://www.farnell.com/datasheets/1856333.pdf?src-supplier=Newark; ComponentLink4URL: http://www.farnell.com/datasheets/1856333.pdf?src-supplier=Element14; ComponentLink4Description: http://www.farnell.com/datasheets/1856333.pdf?src-supplier=Element14; Category: Transistor-BJT
TVS13 = 824014885: TVS DIODE 5V 10.5V DFN3810-9; Manufacturer: Wurth Electronics; Supplier 1: Digi-Key; Supplier Part Number 1: 732-11797-1-ND; Manufacturer Part Number: 824014885; Stock 1: 5123; Pricing 1: 1 = 1,19000, 10 = 1,08000, 100 = 0,97000, 500 = 0,85000, 1000 = 0,76000 (USD); RoHS: No; ComponentLink1URL: https://katalog.we-online.de/pbs/datasheet/824014885.pdf?src-supplier=Digi-Key; ComponentLink1Description: https://katalog.we-online.de/pbs/datasheet/824014885.pdf?src-supplier=Digi-Key; Category: Circuit Protection - TVS - Diodes
XTAL1 = AB26T-32.768KHZ: CRYSTAL 32.7680KHZ 12.5PF T/H; Manufacturer: Abracon; Frequency Tolerance: 20ppm; ESR (Equivalent Series Resistance): 35kR; Frequency Stability: -0.034ppm; Supplier 1: Digi-Key; Supplier Part Number 1: 535-9032-ND; Manufacturer Part Number: AB26T-32.768KHZ; RoHS: Yes; Stock 1: 5808; Pricing 1: 1 = 0,21000, 10 = 0,17500, 50 = 0,15760, 100 = 0,14000, 500 = 0,13300, 1000 = 0,11200, 2500 = 0,10500, 5000 = 0,10150, 10000 = 0,09800 (USD); Mount: Through Hole; Case/Package: Radial; Min Operating Temperature: -10°C; Max Operating Temperature: 60°C; Frequency: 32.768kHz; Packaging: Bulk; Package Quantity: 500; Load Capacitance: 12.5pF; Termination: Radial; Tolerance: 20ppm; Series Resistance: 35kR; Length: 2.1mm; Height: 0.244inch; Lead Pitch: 0.8mm; REACH SVHC: Unknown; Lead Free: Lead Free; ComponentLink1URL: https://datasheet.ciiva.com/3174/ab26t-3174133.pdf?src-supplier=Avnet; ComponentLink1Description: https://datasheet.ciiva.com/3174/ab26t-3174133.pdf?src-supplier=Avnet; ComponentLink2URL: https://datasheet.ciiva.com/16506/ab26t-16506517.pdf?src-supplier=Future+Electronics; ComponentLink2Description: https://datasheet.ciiva.com/16506/ab26t-16506517.pdf?src-supplier=Future+Electronics; ComponentLink3URL: https://datasheet.ciiva.com/15223/getdatasheetpartid-720060-15223238.pdf?src-supplier=Verical; ComponentLink3Description: https://datasheet.ciiva.com/15223/getdatasheetpartid-720060-15223238.pdf?src-supplier=Verical; ComponentLink4URL: https://datasheet.ciiva.com/854/ab26t-854460.pdf?src-supplier=Digi-Key; ComponentLink4Description: https://datasheet.ciiva.com/854/ab26t-854460.pdf?src-supplier=Digi-Key; Category: Crystals

## Nets that join several sheets
+3V3: USB_To_RS232 (34 pins), USB_TO_RS232/RS232_1 (7 pins), USB_TO_RS232/RS232_2 (7 pins), USB_TO_RS232/RS232_3 (7 pins), USB_TO_RS232/RS232_4 (7 pins), USB_TO_RS232/RS232_5 (7 pins), USB_TO_RS232/RS232_6 (7 pins), USB_TO_RS232/RS232_7 (7 pins), USB_TO_RS232/RS232_8 (7 pins), USB_Hub (20 pins), RaspberyConnector (11 pins), Power (R51.2 R52.2), PORT_EXPANDER (19 pins), SENSORS (16 pins), RTC_SD_HDMI (5 pins)
+5V: USB_TO_RS232/RS232_1 (C38_RS232_1.1 IC31_RS232_1.2), USB_TO_RS232/RS232_2 (C38_RS232_2.1 IC31_RS232_2.2), USB_TO_RS232/RS232_3 (C38_RS232_3.1 IC31_RS232_3.2), USB_TO_RS232/RS232_4 (C38_RS232_4.1 IC31_RS232_4.2), USB_TO_RS232/RS232_5 (C38_RS232_5.1 IC31_RS232_5.2), USB_TO_RS232/RS232_6 (C38_RS232_6.1 IC31_RS232_6.2), USB_TO_RS232/RS232_7 (C38_RS232_7.1 IC31_RS232_7.2), USB_TO_RS232/RS232_8 (C38_RS232_8.1 IC31_RS232_8.2), USB_Hub (9 pins), RaspberyConnector (8 pins), Power (R49.2 R50.2), PORT_EXPANDER (5 pins), RTC_SD_HDMI (6 pins)
CHASSIS: USB_Hub (CON11.Shell), RaspberyConnector (CON5.Shell SW1.3 SW2.3), RTC_SD_HDMI (CON9.20)
GND: USB_To_RS232 (56 pins), USB_TO_RS232/RS232_1 (9 pins), USB_TO_RS232/RS232_2 (9 pins), USB_TO_RS232/RS232_3 (9 pins), USB_TO_RS232/RS232_4 (9 pins), USB_TO_RS232/RS232_5 (9 pins), USB_TO_RS232/RS232_6 (9 pins), USB_TO_RS232/RS232_7 (9 pins), USB_TO_RS232/RS232_8 (9 pins), USB_Hub (61 pins), RaspberyConnector (95 pins), Power (R53.2 R54.2), PORT_EXPANDER (16 pins), SENSORS (22 pins), RTC_SD_HDMI (21 pins)
BUZZER: RaspberyConnector (CON3.45), RTC_SD_HDMI (R81.2)
GLOBAL_EN_PIN: RaspberyConnector (CON3.99 J18.1 SW1.2), RTC_SD_HDMI (R78.1)
GPIO02: RaspberyConnector (CON3.58), PORT_EXPANDER (IC7.4 IC10.13 J10.3 J11.3), SENSORS (IC2.14 IC3.1 IC4.4 IC5.4)
GPIO03: RaspberyConnector (CON3.56), PORT_EXPANDER (IC7.3 IC10.12 J10.4 J11.4), SENSORS (IC2.13 IC3.2 IC4.2 IC5.1)
GPIO04: RaspberyConnector (CON3.54), PORT_EXPANDER (J3.3)
GPIO09: RaspberyConnector (CON3.40), PORT_EXPANDER (J3.7 J4.4)
GPIO10: RaspberyConnector (CON3.44), PORT_EXPANDER (J3.8 J4.3)
GPIO11: RaspberyConnector (CON3.38), PORT_EXPANDER (J3.6 J4.2)
GPIO16: RaspberyConnector (CON3.29), PORT_EXPANDER (J4.1)
GPIO17: RaspberyConnector (CON3.50), PORT_EXPANDER (J3.5)
GPIO18: RaspberyConnector (CON3.49), PORT_EXPANDER (J3.4)
GPIO20: RaspberyConnector (CON3.27), PORT_EXPANDER (J4.5)
GPIO21: RaspberyConnector (CON3.25), PORT_EXPANDER (J4.7)
GPIO23: RaspberyConnector (CON3.47), Power (R24.1)
GPIO25: RaspberyConnector (CON3.41), RTC_SD_HDMI (R77.1)
HDMI0_CEC: RaspberyConnector (CON4.51), RTC_SD_HDMI (CON9.13)
HDMI0_CLK_N: RaspberyConnector (CON4.90), RTC_SD_HDMI (CON9.12 TVS13.5)
HDMI0_CLK_P: RaspberyConnector (CON4.88), RTC_SD_HDMI (CON9.10 TVS13.6)
HDMI0_HOTPLUG: RaspberyConnector (CON4.53), RTC_SD_HDMI (CON9.19)
HDMI0_SCL: RaspberyConnector (CON4.100), RTC_SD_HDMI (CON9.15)
HDMI0_SDA: RaspberyConnector (CON4.99), RTC_SD_HDMI (CON9.16)
HDMI0_TX0_N: RaspberyConnector (CON4.84), RTC_SD_HDMI (CON9.9 TVS13.4)
HDMI0_TX0_P: RaspberyConnector (CON4.82), RTC_SD_HDMI (CON9.7 TVS13.7)
HDMI0_TX1_N: RaspberyConnector (CON4.78), RTC_SD_HDMI (CON9.6 TVS13.8)
HDMI0_TX1_P: RaspberyConnector (CON4.76), RTC_SD_HDMI (CON9.4 TVS13.2)
HDMI0_TX2_N: RaspberyConnector (CON4.72), RTC_SD_HDMI (CON9.3 TVS13.9)
HDMI0_TX2_P: RaspberyConnector (CON4.70), RTC_SD_HDMI (CON9.1 TVS13.1)
NetIC25_16: USB_To_RS232 (IC25.16), USB_TO_RS232/RS232_1 (IC33_RS232_1.4)
NetIC25_17: USB_To_RS232 (IC25.17), USB_TO_RS232/RS232_1 (IC32_RS232_1.12)
NetIC25_18: USB_To_RS232 (IC25.18), USB_TO_RS232/RS232_1 (IC33_RS232_1.3)
NetIC25_19: USB_To_RS232 (IC25.19), USB_TO_RS232/RS232_1 (IC32_RS232_1.11)
NetIC25_21: USB_To_RS232 (IC25.21), USB_TO_RS232/RS232_1 (IC33_RS232_1.5)
NetIC25_22: USB_To_RS232 (IC25.22), USB_TO_RS232/RS232_1 (IC32_RS232_1.13)
NetIC25_23: USB_To_RS232 (IC25.23), USB_TO_RS232/RS232_1 (IC32_RS232_1.14)
NetIC25_24: USB_To_RS232 (IC25.24), USB_TO_RS232/RS232_1 (IC33_RS232_1.6)
NetIC25_26: USB_To_RS232 (IC25.26), USB_TO_RS232/RS232_2 (IC33_RS232_2.4)
NetIC25_27: USB_To_RS232 (IC25.27), USB_TO_RS232/RS232_2 (IC32_RS232_2.12)
NetIC25_28: USB_To_RS232 (IC25.28), USB_TO_RS232/RS232_2 (IC33_RS232_2.3)
NetIC25_29: USB_To_RS232 (IC25.29), USB_TO_RS232/RS232_2 (IC32_RS232_2.11)
NetIC25_30: USB_To_RS232 (IC25.30), USB_TO_RS232/RS232_2 (IC33_RS232_2.5)
NetIC25_32: USB_To_RS232 (IC25.32), USB_TO_RS232/RS232_2 (IC32_RS232_2.13)
NetIC25_33: USB_To_RS232 (IC25.33), USB_TO_RS232/RS232_2 (IC32_RS232_2.14)
NetIC25_34: USB_To_RS232 (IC25.34), USB_TO_RS232/RS232_2 (IC33_RS232_2.6)
NetIC25_38: USB_To_RS232 (IC25.38), USB_TO_RS232/RS232_3 (IC33_RS232_3.4)
NetIC25_39: USB_To_RS232 (IC25.39), USB_TO_RS232/RS232_3 (IC32_RS232_3.12)
NetIC25_40: USB_To_RS232 (IC25.40), USB_TO_RS232/RS232_3 (IC33_RS232_3.3)
NetIC25_41: USB_To_RS232 (IC25.41), USB_TO_RS232/RS232_3 (IC32_RS232_3.11)
NetIC25_43: USB_To_RS232 (IC25.43), USB_TO_RS232/RS232_3 (IC33_RS232_3.5)
NetIC25_44: USB_To_RS232 (IC25.44), USB_TO_RS232/RS232_3 (IC32_RS232_3.13)
NetIC25_45: USB_To_RS232 (IC25.45), USB_TO_RS232/RS232_3 (IC32_RS232_3.14)
NetIC25_46: USB_To_RS232 (IC25.46), USB_TO_RS232/RS232_3 (IC33_RS232_3.6)
NetIC25_48: USB_To_RS232 (IC25.48), USB_TO_RS232/RS232_4 (IC33_RS232_4.4)
NetIC25_52: USB_To_RS232 (IC25.52), USB_TO_RS232/RS232_4 (IC32_RS232_4.12)
NetIC25_53: USB_To_RS232 (IC25.53), USB_TO_RS232/RS232_4 (IC33_RS232_4.3)
NetIC25_54: USB_To_RS232 (IC25.54), USB_TO_RS232/RS232_4 (IC32_RS232_4.11)
NetIC25_55: USB_To_RS232 (IC25.55), USB_TO_RS232/RS232_4 (IC33_RS232_4.5)
NetIC25_57: USB_To_RS232 (IC25.57), USB_TO_RS232/RS232_4 (IC32_RS232_4.13)
NetIC25_58: USB_To_RS232 (IC25.58), USB_TO_RS232/RS232_4 (IC32_RS232_4.14)
NetIC25_59: USB_To_RS232 (IC25.59), USB_TO_RS232/RS232_4 (IC33_RS232_4.6)
NetIC27_16: USB_To_RS232 (IC27.16), USB_TO_RS232/RS232_5 (IC33_RS232_5.4)
NetIC27_17: USB_To_RS232 (IC27.17), USB_TO_RS232/RS232_5 (IC32_RS232_5.12)
NetIC27_18: USB_To_RS232 (IC27.18), USB_TO_RS232/RS232_5 (IC33_RS232_5.3)
NetIC27_19: USB_To_RS232 (IC27.19), USB_TO_RS232/RS232_5 (IC32_RS232_5.11)
NetIC27_21: USB_To_RS232 (IC27.21), USB_TO_RS232/RS232_5 (IC33_RS232_5.5)
NetIC27_22: USB_To_RS232 (IC27.22), USB_TO_RS232/RS232_5 (IC32_RS232_5.13)
NetIC27_23: USB_To_RS232 (IC27.23), USB_TO_RS232/RS232_5 (IC32_RS232_5.14)
NetIC27_24: USB_To_RS232 (IC27.24), USB_TO_RS232/RS232_5 (IC33_RS232_5.6)
NetIC27_26: USB_To_RS232 (IC27.26), USB_TO_RS232/RS232_6 (IC33_RS232_6.4)
NetIC27_27: USB_To_RS232 (IC27.27), USB_TO_RS232/RS232_6 (IC32_RS232_6.12)
NetIC27_28: USB_To_RS232 (IC27.28), USB_TO_RS232/RS232_6 (IC33_RS232_6.3)
NetIC27_29: USB_To_RS232 (IC27.29), USB_TO_RS232/RS232_6 (IC32_RS232_6.11)
NetIC27_30: USB_To_RS232 (IC27.30), USB_TO_RS232/RS232_6 (IC33_RS232_6.5)
NetIC27_32: USB_To_RS232 (IC27.32), USB_TO_RS232/RS232_6 (IC32_RS232_6.13)
NetIC27_33: USB_To_RS232 (IC27.33), USB_TO_RS232/RS232_6 (IC32_RS232_6.14)
NetIC27_34: USB_To_RS232 (IC27.34), USB_TO_RS232/RS232_6 (IC33_RS232_6.6)
NetIC27_38: USB_To_RS232 (IC27.38), USB_TO_RS232/RS232_7 (IC33_RS232_7.4)
NetIC27_39: USB_To_RS232 (IC27.39), USB_TO_RS232/RS232_7 (IC32_RS232_7.12)
NetIC27_40: USB_To_RS232 (IC27.40), USB_TO_RS232/RS232_7 (IC33_RS232_7.3)
NetIC27_41: USB_To_RS232 (IC27.41), USB_TO_RS232/RS232_7 (IC32_RS232_7.11)
NetIC27_43: USB_To_RS232 (IC27.43), USB_TO_RS232/RS232_7 (IC33_RS232_7.5)
NetIC27_44: USB_To_RS232 (IC27.44), USB_TO_RS232/RS232_7 (IC32_RS232_7.13)
NetIC27_45: USB_To_RS232 (IC27.45), USB_TO_RS232/RS232_7 (IC32_RS232_7.14)
NetIC27_46: USB_To_RS232 (IC27.46), USB_TO_RS232/RS232_7 (IC33_RS232_7.6)
NetIC27_48: USB_To_RS232 (IC27.48), USB_TO_RS232/RS232_8 (IC33_RS232_8.4)
NetIC27_52: USB_To_RS232 (IC27.52), USB_TO_RS232/RS232_8 (IC32_RS232_8.12)
NetIC27_53: USB_To_RS232 (IC27.53), USB_TO_RS232/RS232_8 (IC33_RS232_8.3)
NetIC27_54: USB_To_RS232 (IC27.54), USB_TO_RS232/RS232_8 (IC32_RS232_8.11)
NetIC27_55: USB_To_RS232 (IC27.55), USB_TO_RS232/RS232_8 (IC33_RS232_8.5)
NetIC27_57: USB_To_RS232 (IC27.57), USB_TO_RS232/RS232_8 (IC32_RS232_8.13)
NetIC27_58: USB_To_RS232 (IC27.58), USB_TO_RS232/RS232_8 (IC32_RS232_8.14)
NetIC27_59: USB_To_RS232 (IC27.59), USB_TO_RS232/RS232_8 (IC33_RS232_8.6)
nEXTRST: USB_Hub (R91.1), RaspberyConnector (CON3.100)
RS232_GND: USB_To_RS232 (CON18.9), USB_TO_RS232/RS232_5 (24 pins)
RS232_GND: USB_To_RS232 (CON19.9), USB_TO_RS232/RS232_6 (24 pins)
RS232_GND: USB_To_RS232 (CON20.9), USB_TO_RS232/RS232_7 (24 pins)
RS232_GND: USB_To_RS232 (CON21.9), USB_TO_RS232/RS232_8 (24 pins)
RS232_GND: USB_To_RS232 (CON14.9), USB_TO_RS232/RS232_1 (24 pins)
RS232_GND: USB_To_RS232 (CON15.9), USB_TO_RS232/RS232_2 (24 pins)
RS232_GND: USB_To_RS232 (CON16.9), USB_TO_RS232/RS232_3 (24 pins)
RS232_GND: USB_To_RS232 (CON17.9), USB_TO_RS232/RS232_4 (24 pins)
RS_CTS: USB_To_RS232 (CON18.6), USB_TO_RS232/RS232_5 (IC14_RS232_5.7 TVS3_RS232_5.1)
RS_CTS: USB_To_RS232 (CON19.6), USB_TO_RS232/RS232_6 (IC14_RS232_6.7 TVS3_RS232_6.1)
RS_CTS: USB_To_RS232 (CON20.6), USB_TO_RS232/RS232_7 (IC14_RS232_7.7 TVS3_RS232_7.1)
RS_CTS: USB_To_RS232 (CON21.6), USB_TO_RS232/RS232_8 (IC14_RS232_8.7 TVS3_RS232_8.1)
RS_CTS: USB_To_RS232 (CON14.6), USB_TO_RS232/RS232_1 (IC14_RS232_1.7 TVS3_RS232_1.1)
RS_CTS: USB_To_RS232 (CON15.6), USB_TO_RS232/RS232_2 (IC14_RS232_2.7 TVS3_RS232_2.1)
RS_CTS: USB_To_RS232 (CON16.6), USB_TO_RS232/RS232_3 (IC14_RS232_3.7 TVS3_RS232_3.1)
RS_CTS: USB_To_RS232 (CON17.6), USB_TO_RS232/RS232_4 (IC14_RS232_4.7 TVS3_RS232_4.1)
RS_DCD: USB_To_RS232 (CON18.1), USB_TO_RS232/RS232_5 (IC14_RS232_5.5 TVS1_RS232_5.2)
RS_DCD: USB_To_RS232 (CON19.1), USB_TO_RS232/RS232_6 (IC14_RS232_6.5 TVS1_RS232_6.2)
RS_DCD: USB_To_RS232 (CON20.1), USB_TO_RS232/RS232_7 (IC14_RS232_7.5 TVS1_RS232_7.2)
RS_DCD: USB_To_RS232 (CON21.1), USB_TO_RS232/RS232_8 (IC14_RS232_8.5 TVS1_RS232_8.2)
RS_DCD: USB_To_RS232 (CON14.1), USB_TO_RS232/RS232_1 (IC14_RS232_1.5 TVS1_RS232_1.2)
RS_DCD: USB_To_RS232 (CON15.1), USB_TO_RS232/RS232_2 (IC14_RS232_2.5 TVS1_RS232_2.2)
RS_DCD: USB_To_RS232 (CON16.1), USB_TO_RS232/RS232_3 (IC14_RS232_3.5 TVS1_RS232_3.2)
RS_DCD: USB_To_RS232 (CON17.1), USB_TO_RS232/RS232_4 (IC14_RS232_4.5 TVS1_RS232_4.2)
RS_DSR: USB_To_RS232 (CON18.2), USB_TO_RS232/RS232_5 (IC14_RS232_5.4 TVS1_RS232_5.1)
RS_DSR: USB_To_RS232 (CON19.2), USB_TO_RS232/RS232_6 (IC14_RS232_6.4 TVS1_RS232_6.1)
RS_DSR: USB_To_RS232 (CON20.2), USB_TO_RS232/RS232_7 (IC14_RS232_7.4 TVS1_RS232_7.1)
RS_DSR: USB_To_RS232 (CON21.2), USB_TO_RS232/RS232_8 (IC14_RS232_8.4 TVS1_RS232_8.1)
RS_DSR: USB_To_RS232 (CON14.2), USB_TO_RS232/RS232_1 (IC14_RS232_1.4 TVS1_RS232_1.1)
RS_DSR: USB_To_RS232 (CON15.2), USB_TO_RS232/RS232_2 (IC14_RS232_2.4 TVS1_RS232_2.1)
RS_DSR: USB_To_RS232 (CON16.2), USB_TO_RS232/RS232_3 (IC14_RS232_3.4 TVS1_RS232_3.1)
RS_DSR: USB_To_RS232 (CON17.2), USB_TO_RS232/RS232_4 (IC14_RS232_4.4 TVS1_RS232_4.1)
RS_DTR: USB_To_RS232 (CON18.7), USB_TO_RS232/RS232_5 (IC14_RS232_5.10 TVS4_RS232_5.2)
RS_DTR: USB_To_RS232 (CON19.7), USB_TO_RS232/RS232_6 (IC14_RS232_6.10 TVS4_RS232_6.2)
RS_DTR: USB_To_RS232 (CON20.7), USB_TO_RS232/RS232_7 (IC14_RS232_7.10 TVS4_RS232_7.2)
RS_DTR: USB_To_RS232 (CON21.7), USB_TO_RS232/RS232_8 (IC14_RS232_8.10 TVS4_RS232_8.2)
RS_DTR: USB_To_RS232 (CON14.7), USB_TO_RS232/RS232_1 (IC14_RS232_1.10 TVS4_RS232_1.2)
RS_DTR: USB_To_RS232 (CON15.7), USB_TO_RS232/RS232_2 (IC14_RS232_2.10 TVS4_RS232_2.2)
RS_DTR: USB_To_RS232 (CON16.7), USB_TO_RS232/RS232_3 (IC14_RS232_3.10 TVS4_RS232_3.2)
RS_DTR: USB_To_RS232 (CON17.7), USB_TO_RS232/RS232_4 (IC14_RS232_4.10 TVS4_RS232_4.2)
RS_RI: USB_To_RS232 (CON18.8), USB_TO_RS232/RS232_5 (IC14_RS232_5.8 TVS4_RS232_5.1)
RS_RI: USB_To_RS232 (CON19.8), USB_TO_RS232/RS232_6 (IC14_RS232_6.8 TVS4_RS232_6.1)
RS_RI: USB_To_RS232 (CON20.8), USB_TO_RS232/RS232_7 (IC14_RS232_7.8 TVS4_RS232_7.1)
RS_RI: USB_To_RS232 (CON21.8), USB_TO_RS232/RS232_8 (IC14_RS232_8.8 TVS4_RS232_8.1)
RS_RI: USB_To_RS232 (CON14.8), USB_TO_RS232/RS232_1 (IC14_RS232_1.8 TVS4_RS232_1.1)
RS_RI: USB_To_RS232 (CON15.8), USB_TO_RS232/RS232_2 (IC14_RS232_2.8 TVS4_RS232_2.1)
RS_RI: USB_To_RS232 (CON16.8), USB_TO_RS232/RS232_3 (IC14_RS232_3.8 TVS4_RS232_3.1)
RS_RI: USB_To_RS232 (CON17.8), USB_TO_RS232/RS232_4 (IC14_RS232_4.8 TVS4_RS232_4.1)
RS_RTS: USB_To_RS232 (CON18.4), USB_TO_RS232/RS232_5 (IC14_RS232_5.9 TVS2_RS232_5.1)
RS_RTS: USB_To_RS232 (CON19.4), USB_TO_RS232/RS232_6 (IC14_RS232_6.9 TVS2_RS232_6.1)
RS_RTS: USB_To_RS232 (CON20.4), USB_TO_RS232/RS232_7 (IC14_RS232_7.9 TVS2_RS232_7.1)
RS_RTS: USB_To_RS232 (CON21.4), USB_TO_RS232/RS232_8 (IC14_RS232_8.9 TVS2_RS232_8.1)
RS_RTS: USB_To_RS232 (CON14.4), USB_TO_RS232/RS232_1 (IC14_RS232_1.9 TVS2_RS232_1.1)
RS_RTS: USB_To_RS232 (CON15.4), USB_TO_RS232/RS232_2 (IC14_RS232_2.9 TVS2_RS232_2.1)
RS_RTS: USB_To_RS232 (CON16.4), USB_TO_RS232/RS232_3 (IC14_RS232_3.9 TVS2_RS232_3.1)
RS_RTS: USB_To_RS232 (CON17.4), USB_TO_RS232/RS232_4 (IC14_RS232_4.9 TVS2_RS232_4.1)
RS_RX: USB_To_RS232 (CON18.3), USB_TO_RS232/RS232_5 (IC14_RS232_5.6 TVS2_RS232_5.2)
RS_RX: USB_To_RS232 (CON19.3), USB_TO_RS232/RS232_6 (IC14_RS232_6.6 TVS2_RS232_6.2)
RS_RX: USB_To_RS232 (CON20.3), USB_TO_RS232/RS232_7 (IC14_RS232_7.6 TVS2_RS232_7.2)
RS_RX: USB_To_RS232 (CON21.3), USB_TO_RS232/RS232_8 (IC14_RS232_8.6 TVS2_RS232_8.2)
RS_RX: USB_To_RS232 (CON14.3), USB_TO_RS232/RS232_1 (IC14_RS232_1.6 TVS2_RS232_1.2)
RS_RX: USB_To_RS232 (CON15.3), USB_TO_RS232/RS232_2 (IC14_RS232_2.6 TVS2_RS232_2.2)
RS_RX: USB_To_RS232 (CON16.3), USB_TO_RS232/RS232_3 (IC14_RS232_3.6 TVS2_RS232_3.2)
RS_RX: USB_To_RS232 (CON17.3), USB_TO_RS232/RS232_4 (IC14_RS232_4.6 TVS2_RS232_4.2)
RS_TXD: USB_To_RS232 (CON18.5), USB_TO_RS232/RS232_5 (IC14_RS232_5.11 TVS3_RS232_5.2)
RS_TXD: USB_To_RS232 (CON19.5), USB_TO_RS232/RS232_6 (IC14_RS232_6.11 TVS3_RS232_6.2)
RS_TXD: USB_To_RS232 (CON20.5), USB_TO_RS232/RS232_7 (IC14_RS232_7.11 TVS3_RS232_7.2)
RS_TXD: USB_To_RS232 (CON21.5), USB_TO_RS232/RS232_8 (IC14_RS232_8.11 TVS3_RS232_8.2)
RS_TXD: USB_To_RS232 (CON14.5), USB_TO_RS232/RS232_1 (IC14_RS232_1.11 TVS3_RS232_1.2)
RS_TXD: USB_To_RS232 (CON15.5), USB_TO_RS232/RS232_2 (IC14_RS232_2.11 TVS3_RS232_2.2)
RS_TXD: USB_To_RS232 (CON16.5), USB_TO_RS232/RS232_3 (IC14_RS232_3.11 TVS3_RS232_3.2)
RS_TXD: USB_To_RS232 (CON17.5), USB_TO_RS232/RS232_4 (IC14_RS232_4.11 TVS3_RS232_4.2)
SCL0: RaspberyConnector (CON3.80 J14.20 J15.20), RTC_SD_HDMI (IC18.6)
SD_CLK: RaspberyConnector (CON3.57), RTC_SD_HDMI (CON10.5)
SD_CMD: RaspberyConnector (CON3.62), RTC_SD_HDMI (CON10.3)
SD_DAT0: RaspberyConnector (CON3.63), RTC_SD_HDMI (CON10.7)
SD_DAT1: RaspberyConnector (CON3.67), RTC_SD_HDMI (CON10.8)
SD_DAT2: RaspberyConnector (CON3.69), RTC_SD_HDMI (CON10.1)
SD_DAT3: RaspberyConnector (CON3.61), RTC_SD_HDMI (CON10.2)
SD_PWR_ON: RaspberyConnector (CON3.75), RTC_SD_HDMI (IC19.3 R79.1)
SDA0: RaspberyConnector (CON3.82 J14.21 J15.21), RTC_SD_HDMI (IC18.5)
USB_1_N: USB_To_RS232 (CM3.2), USB_Hub (IC22.9)
USB_1_P: USB_To_RS232 (CM3.3), USB_Hub (IC22.8)
USB_2_N: USB_To_RS232 (CM4.4), USB_Hub (IC22.5)
USB_2_P: USB_To_RS232 (CM4.1), USB_Hub (IC22.6)
USB_N: USB_Hub (IC24.6), RaspberyConnector (CON4.3)
USB_OTG_ID: USB_Hub (IC24.1 R104.1 R108.2), RaspberyConnector (CON4.1)
USB_P: USB_Hub (IC24.4), RaspberyConnector (CON4.5)